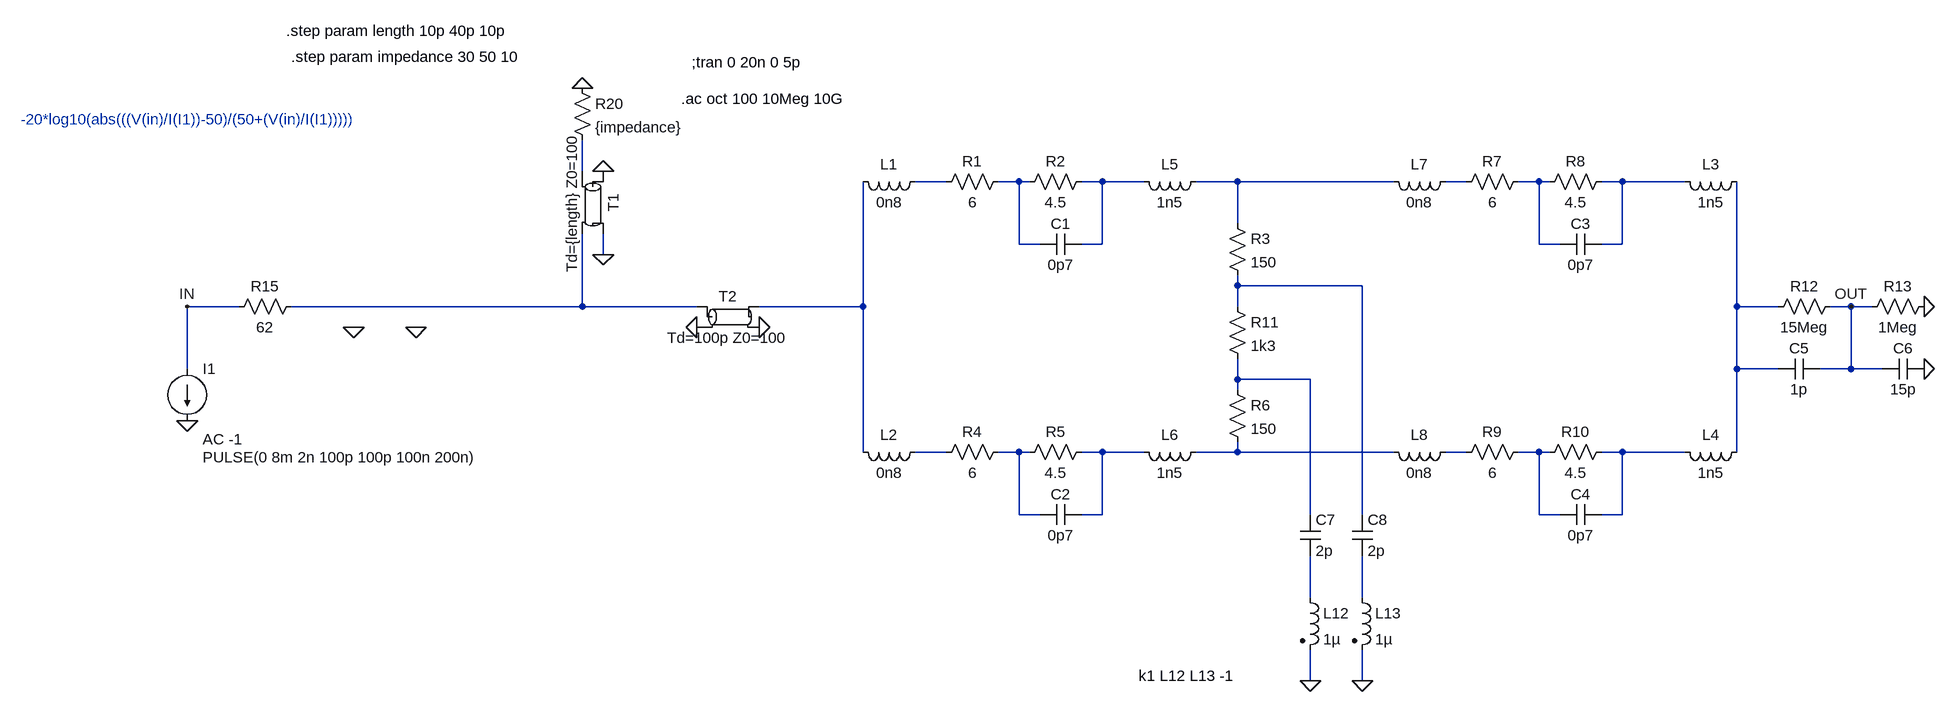
[diagram p0: schematic Draft13.asc]
Draft13.asc, the LTspice schematic file:
Version 4
SHEET 1 1476 1316
WIRE -608 -32 -608 -80
WIRE -48 -16 -96 -16
WIRE 64 -16 32 -16
WIRE 80 -16 64 -16
WIRE 192 -16 160 -16
WIRE 256 -16 192 -16
WIRE 400 -16 336 -16
WIRE 640 -16 400 -16
WIRE 752 -16 720 -16
WIRE 864 -16 832 -16
WIRE 880 -16 864 -16
WIRE 992 -16 960 -16
WIRE 1088 -16 992 -16
WIRE 400 48 400 -16
WIRE 64 80 64 -16
WIRE 96 80 64 80
WIRE 192 80 192 -16
WIRE 192 80 160 80
WIRE 864 80 864 -16
WIRE 896 80 864 80
WIRE 992 80 992 -16
WIRE 992 80 960 80
WIRE -576 96 -576 64
WIRE 400 144 400 128
WIRE 592 144 400 144
WIRE -1136 176 -1216 176
WIRE -608 176 -608 64
WIRE -608 176 -1056 176
WIRE -432 176 -608 176
WIRE -176 176 -176 -16
WIRE -176 176 -336 176
WIRE 400 176 400 144
WIRE 1168 176 1168 -16
WIRE 1232 176 1168 176
WIRE 1344 176 1312 176
WIRE 1376 176 1344 176
WIRE -1216 272 -1216 176
WIRE 1168 272 1168 176
WIRE 1232 272 1168 272
WIRE 1344 272 1344 176
WIRE 1344 272 1296 272
WIRE 1392 272 1344 272
WIRE 400 288 400 256
WIRE 512 288 400 288
WIRE 400 304 400 288
WIRE -176 400 -176 176
WIRE -48 400 -96 400
WIRE 64 400 32 400
WIRE 80 400 64 400
WIRE 192 400 160 400
WIRE 256 400 192 400
WIRE 400 400 400 384
WIRE 400 400 336 400
WIRE 640 400 400 400
WIRE 752 400 720 400
WIRE 864 400 832 400
WIRE 880 400 864 400
WIRE 992 400 960 400
WIRE 1088 400 992 400
WIRE 1168 400 1168 272
WIRE 64 496 64 400
WIRE 96 496 64 496
WIRE 192 496 192 400
WIRE 192 496 160 496
WIRE 512 496 512 288
WIRE 592 496 592 144
WIRE 864 496 864 400
WIRE 896 496 864 496
WIRE 992 496 992 400
WIRE 992 496 960 496
WIRE 512 624 512 560
WIRE 592 624 592 560
WIRE 512 752 512 704
WIRE 592 752 592 704
FLAG 1456 176 0
FLAG 1456 272 0
FLAG -1216 352 0
FLAG -1216 176 IN
FLAG 512 752 0
FLAG 592 752 0
FLAG 1344 176 OUT
FLAG -576 96 0
FLAG -576 -32 0
FLAG -608 -160 0
FLAG -336 208 0
FLAG -432 208 0
FLAG -864 208 0
FLAG -960 208 0
SYMBOL res 48 -32 R90
WINDOW 0 0 56 VBottom 2
WINDOW 3 32 56 VTop 2
SYMATTR InstName R1
SYMATTR Value 6
SYMBOL res 176 -32 R90
WINDOW 0 0 56 VBottom 2
WINDOW 3 32 56 VTop 2
SYMATTR InstName R2
SYMATTR Value 4.5
SYMBOL cap 160 64 R90
WINDOW 0 0 32 VBottom 2
WINDOW 3 32 32 VTop 2
SYMATTR InstName C1
SYMATTR Value 0p7
SYMBOL res 384 32 R0
SYMATTR InstName R3
SYMATTR Value 150
SYMBOL res 48 384 R90
WINDOW 0 0 56 VBottom 2
WINDOW 3 32 56 VTop 2
SYMATTR InstName R4
SYMATTR Value 6
SYMBOL res 176 384 R90
WINDOW 0 0 56 VBottom 2
WINDOW 3 32 56 VTop 2
SYMATTR InstName R5
SYMATTR Value 4.5
SYMBOL cap 160 480 R90
WINDOW 0 0 32 VBottom 2
WINDOW 3 32 32 VTop 2
SYMATTR InstName C2
SYMATTR Value 0p7
SYMBOL res 384 288 R0
SYMATTR InstName R6
SYMATTR Value 150
SYMBOL res 848 -32 R90
WINDOW 0 0 56 VBottom 2
WINDOW 3 32 56 VTop 2
SYMATTR InstName R7
SYMATTR Value 6
SYMBOL res 976 -32 R90
WINDOW 0 0 56 VBottom 2
WINDOW 3 32 56 VTop 2
SYMATTR InstName R8
SYMATTR Value 4.5
SYMBOL cap 960 64 R90
WINDOW 0 0 32 VBottom 2
WINDOW 3 32 32 VTop 2
SYMATTR InstName C3
SYMATTR Value 0p7
SYMBOL res 848 384 R90
WINDOW 0 0 56 VBottom 2
WINDOW 3 32 56 VTop 2
SYMATTR InstName R9
SYMATTR Value 6
SYMBOL res 976 384 R90
WINDOW 0 0 56 VBottom 2
WINDOW 3 32 56 VTop 2
SYMATTR InstName R10
SYMATTR Value 4.5
SYMBOL cap 960 480 R90
WINDOW 0 0 32 VBottom 2
WINDOW 3 32 32 VTop 2
SYMATTR InstName C4
SYMATTR Value 0p7
SYMBOL res 384 160 R0
SYMATTR InstName R11
SYMATTR Value 1k3
SYMBOL res 1328 160 R90
WINDOW 0 0 56 VBottom 2
WINDOW 3 32 56 VTop 2
SYMATTR InstName R12
SYMATTR Value 15Meg
SYMBOL res 1472 160 R90
WINDOW 0 0 56 VBottom 2
WINDOW 3 32 56 VTop 2
SYMATTR InstName R13
SYMATTR Value 1Meg
SYMBOL cap 1296 256 R90
WINDOW 0 0 32 VBottom 2
WINDOW 3 32 32 VTop 2
SYMATTR InstName C5
SYMATTR Value 1p
SYMBOL cap 1456 256 R90
WINDOW 0 0 32 VBottom 2
WINDOW 3 32 32 VTop 2
SYMATTR InstName C6
SYMATTR Value 15p
SYMBOL current -1216 272 R0
WINDOW 3 24 136 Left 2
WINDOW 123 24 108 Left 2
WINDOW 39 0 0 Left 0
SYMATTR Value PULSE(0 8m 2n 100p 100p 100n 200n)
SYMATTR Value2 AC -1
SYMATTR InstName I1
SYMBOL ind -80 -32 R90
WINDOW 0 5 56 VBottom 2
WINDOW 3 32 56 VTop 2
SYMATTR InstName L1
SYMATTR Value 0n8
SYMBOL ind -80 384 R90
WINDOW 0 5 56 VBottom 2
WINDOW 3 32 56 VTop 2
SYMATTR InstName L2
SYMATTR Value 0n8
SYMBOL ind 1184 -32 R90
WINDOW 0 5 56 VBottom 2
WINDOW 3 32 56 VTop 2
SYMATTR InstName L3
SYMATTR Value 1n5
SYMBOL ind 1184 384 R90
WINDOW 0 5 56 VBottom 2
WINDOW 3 32 56 VTop 2
SYMATTR InstName L4
SYMATTR Value 1n5
SYMBOL cap 496 496 R0
SYMATTR InstName C7
SYMATTR Value 2p
SYMBOL cap 576 496 R0
SYMATTR InstName C8
SYMATTR Value 2p
SYMBOL res -1040 160 R90
WINDOW 0 0 56 VBottom 2
WINDOW 3 32 56 VTop 2
SYMATTR InstName R15
SYMATTR Value 62
SYMBOL ind 352 -32 R90
WINDOW 0 5 56 VBottom 2
WINDOW 3 32 56 VTop 2
SYMATTR InstName L5
SYMATTR Value 1n5
SYMBOL ind 352 384 R90
WINDOW 0 5 56 VBottom 2
WINDOW 3 32 56 VTop 2
SYMATTR InstName L6
SYMATTR Value 1n5
SYMBOL ind 736 -32 R90
WINDOW 0 5 56 VBottom 2
WINDOW 3 32 56 VTop 2
SYMATTR InstName L7
SYMATTR Value 0n8
SYMBOL ind 736 384 R90
WINDOW 0 5 56 VBottom 2
WINDOW 3 32 56 VTop 2
SYMATTR InstName L8
SYMATTR Value 0n8
SYMBOL ind2 496 608 R0
SYMATTR InstName L12
SYMATTR Value 1µ
SYMATTR Type ind
SYMBOL ind2 576 608 R0
SYMATTR InstName L13
SYMATTR Value 1µ
SYMATTR Type ind
SYMBOL tline -592 16 R90
SYMATTR InstName T1
SYMATTR Value Td={length} Z0=100
SYMBOL res -624 -176 R0
SYMATTR InstName R20
SYMATTR Value {impedance}
SYMBOL tline -384 192 R0
SYMATTR InstName T2
SYMATTR Value Td=100p Z0=100
TEXT -456 -144 Left 2 !.ac oct 100 10Meg 10G
TEXT -440 -200 Left 2 !;tran 0 20n 0 5p
TEXT -1472 -112 Left 2 ;-20*log10(abs(((V(in)/I(I1))-50)/(50+(V(in)/I(I1)))))
TEXT 248 744 Left 2 !k1 L12 L13 -1
TEXT -1064 -248 Left 2 !.step param length 10p 40p 10p
TEXT -1056 -208 Left 2 !.step param impedance 30 50 10

The netlist it stands for:
* Draft13.asc
R1 N003 N002 6
R2 N004 N003 4.5
C1 N004 N003 0p7
R3 N005 N009 150
R4 N015 N014 6
R5 N016 N015 4.5
C2 N016 N015 0p7
R6 N013 N017 150
R7 N007 N006 6
R8 N008 N007 4.5
C3 N008 N007 0p7
R9 N019 N018 6
R10 N020 N019 4.5
C4 N020 N019 0p7
R11 N009 N013 1k3
R12 OUT N012 15Meg
R13 0 OUT 1Meg
C5 OUT N012 1p
C6 0 OUT 15p
I1 IN 0 PULSE(0 8m 2n 100p 100p 100n 200n) AC -1
L1 N002 N011 0n8
L2 N014 N011 0n8
L3 N012 N008 1n5
L4 N012 N020 1n5
C7 N013 N021 2p
C8 N009 N022 2p
R15 N010 IN 62
L5 N005 N004 1n5
L6 N017 N016 1n5
L7 N006 N005 0n8
L8 N018 N017 0n8
L12 N021 0 1µ
L13 N022 0 1µ
T1 0 N001 0 N010 Td={length} Z0=100
R20 0 N001 {impedance}
T2 N010 0 N011 0 Td=100p Z0=100
.ac oct 100 10Meg 10G
;tran 0 20n 0 5p
* -20*log10(abs(((V(in)/I(I1))-50)/(50+(V(in)/I(I1)))))
k1 L12 L13 -1
.step param length 10p 40p 10p
.step param impedance 30 50 10
.backanno
.end